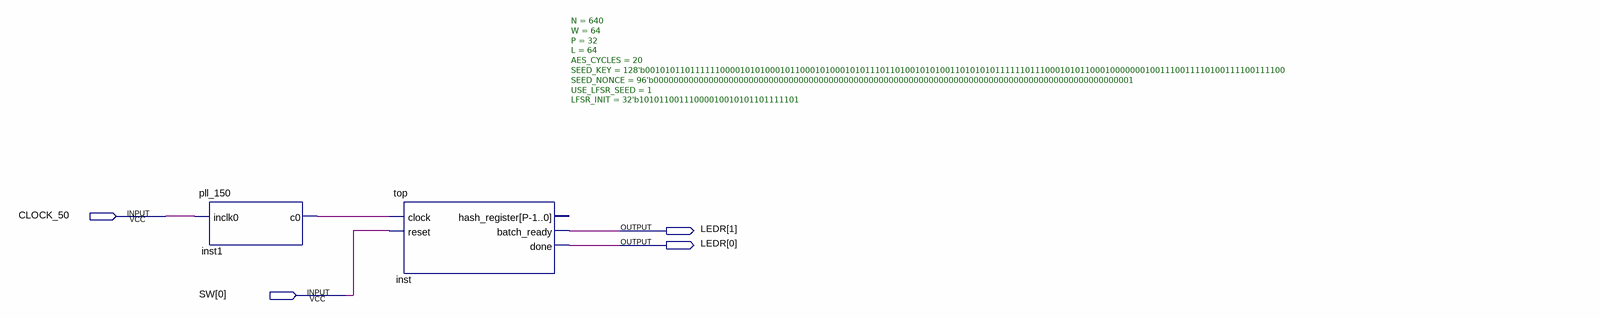
[diagram p0: schematic sheet]
// Quartus schematic privacy_amplification.bdf as structural Verilog: 2 symbols, 4 pins
module privacy_amplification (
  input  CLOCK_50,
  input  [0:0] SW,
  output [1:0] LEDR
);

  wire inst1_c0;

  pll_150 inst1 (.inclk0(CLOCK_50), .c0(inst1_c0));
  top #(.N(640), .W(64), .P(32), .L(64), .AES_CYCLES(20), .SEED_KEY(128'b00101011011111100001010100010110001010001010111011010010101001101010101111110111000101011000100000001001110011110100111100111100), .SEED_NONCE(96'b000000000000000000000000000000000000000000000000000000000000000000000000000000000000000000000001), .USE_LFSR_SEED(1), .LFSR_INIT(32'b10101100111000010010101101111101)) inst (
    .clock(inst1_c0), .reset(SW[0]), .batch_ready(LEDR[1]), .done(LEDR[0]));  // open: hash_register
endmodule
